# EAGLE design Tracksoar v2 breakout (EAGLE 9.0.0)
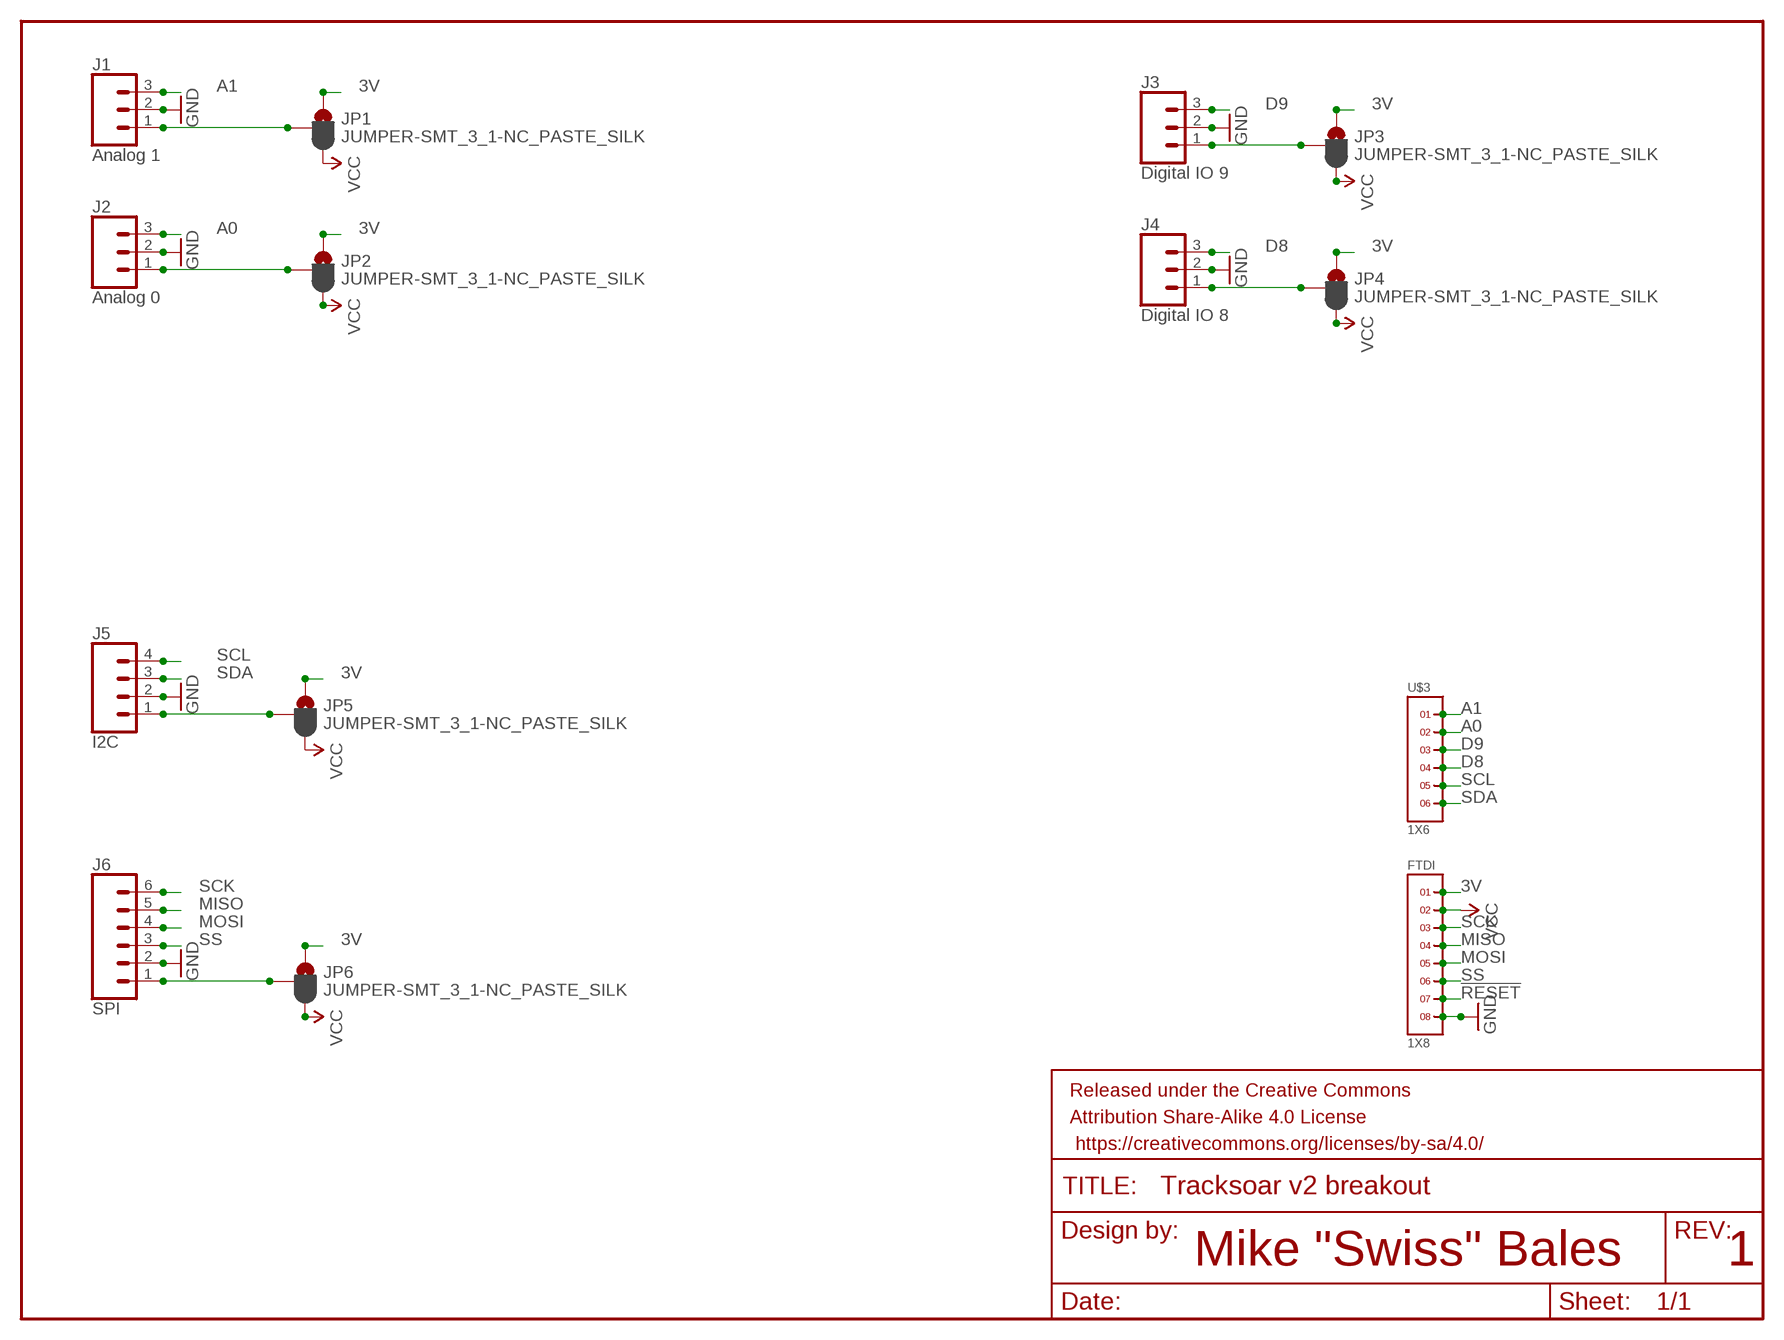
[diagram p0: schematic, sheet 1]

## Parts
FRAME1  FRAME-LETTER  [CREATIVE_COMMONS]
FTDI  1X8  [1X8]
J1  Analog 1  CONN_03LONGPADS  [1X03_LONGPADS]
J2  Analog 0  CONN_03LONGPADS  [1X03_LONGPADS]
J3  Digital IO 9  CONN_03LONGPADS  [1X03_LONGPADS]
J4  Digital IO 8  CONN_03LONGPADS  [1X03_LONGPADS]
J5  I2C  CONN_04LONGPADS  [1X04_LONGPADS]
J6  SPI  CONN_06LONGPADS  [1X06_LONGPADS]
JP1  JUMPER-SMT_3_1-NC_PASTE_SILK  [SMT-JUMPER_3_1-NC_PASTE_SILK]
JP2  JUMPER-SMT_3_1-NC_PASTE_SILK  [SMT-JUMPER_3_1-NC_PASTE_SILK]
JP3  JUMPER-SMT_3_1-NC_PASTE_SILK  [SMT-JUMPER_3_1-NC_PASTE_SILK]
JP4  JUMPER-SMT_3_1-NC_PASTE_SILK  [SMT-JUMPER_3_1-NC_PASTE_SILK]
JP5  JUMPER-SMT_3_1-NC_PASTE_SILK  [SMT-JUMPER_3_1-NC_PASTE_SILK]
JP6  JUMPER-SMT_3_1-NC_PASTE_SILK  [SMT-JUMPER_3_1-NC_PASTE_SILK]
U$3  1X6  [1X6]

## Nets
3V: FTDI.1 JP1.1 JP2.1 JP3.1 JP4.1 JP5.1 JP6.1
!RESET: FTDI.7
A0: J2.3 U$3.2
A1: J1.3 U$3.1
D8: J4.3 U$3.4
D9: J3.3 U$3.3
GND: FTDI.8 J1.2 J2.2 J3.2 J4.2 J5.2 J6.2
MISO: FTDI.4 J6.5
MOSI: FTDI.5 J6.4
N$1: J1.1 JP1.2
N$2: J2.1 JP2.2
N$3: J3.1 JP3.2
N$6: J4.1 JP4.2
N$7: J5.1 JP5.2
N$8: J6.1 JP6.2
SCK: FTDI.3 J6.6
SCL: J5.4 U$3.5
SDA: J5.3 U$3.6
SS: FTDI.6 J6.3
VCC: FTDI.2 JP1.3 JP2.3 JP3.3 JP4.3 JP5.3 JP6.3

## Notes on the sheet
- Mike "Swiss" Bales | 1

## Library data of the parts
FRAME1 = SparkFun-Aesthetics:FRAME-LETTER: Schematic Frame Standard 8.5x11 US Letter frame
FTDI = headers(2mm):1X8
J1-J4 = SparkFun-Connectors:CONN_03: Multi connection point. Often used as Generic Header-pin footprint for 0.1 inch spaced/style header connections On any of the 0.1 inch spaced packages, you can populate with these: Break Away Headers - Straight <https://www.sparkfun.com/products/116> (PRT-00116) Break Away Male Headers - Right Angle <https://www.sparkfun.com/products/553> (PRT-00553) Female Headers <https://www.sparkfun.com/products/115> (PRT-00115) Break Away Headers - Machine Pin <https://www.sparkfun.com/products/117> (PRT-00117) Break Away Female Headers - Swiss Machine Pin <https://www.sparkfun.com/products/743> (PRT-00743) Stackable Header - 3 Pin (Female, 0.1") <https://www.sparkfun.com/products/13875> (PRT-13875) For SCREWTERMINALS and SPRING TERMINALS visit here: Screw Terimnals on SparkFun.com <https://www.sparkfun.com/search/results?term=Screw+Terminals> (5mm/3.5mm/2.54mm spacing) This device is also useful as a general connection point to wire up your design to another part of your project. Our various solder wires solder well into these plated through hole pads. Hook-Up Wire - Assortment (Stranded, 22 AWG) <https://www.sparkfun.com/products/11375> (PRT-11375) Hook-Up Wire - Assortment (Solid Core, 22 AWG) <https://www.sparkfun.com/products/11367> (PRT-11367) View the entire wire category on our website here <https://www.sparkfun.com/categories/141> Special notes: Molex polarized connector foot print use with SKU : PRT-08232 with associated crimp pins and housings.
J5 = SparkFun-Connectors:CONN_04: Multi connection point. Often used as Generic Header-pin footprint for 0.1 inch spaced/style header connections On any of the 0.1 inch spaced packages, you can populate with these: Break Away Headers - Straight <https://www.sparkfun.com/products/116> (PRT-00116) Break Away Male Headers - Right Angle <https://www.sparkfun.com/products/553> (PRT-00553) Female Headers <https://www.sparkfun.com/products/115> (PRT-00115) Break Away Headers - Machine Pin <https://www.sparkfun.com/products/117> (PRT-00117) Break Away Female Headers - Swiss Machine Pin <https://www.sparkfun.com/products/743> (PRT-00743) For SCREWTERMINALS and SPRING TERMINALS visit here: Screw Terimnals on SparkFun.com <https://www.sparkfun.com/search/results?term=Screw+Terminals> (5mm/3.5mm/2.54mm spacing) This device is also useful as a general connection point to wire up your design to another part of your project. Our various solder wires solder well into these plated through hole pads. Hook-Up Wire - Assortment (Stranded, 22 AWG) <https://www.sparkfun.com/products/11375> (PRT-11375) Hook-Up Wire - Assortment (Solid Core, 22 AWG) <https://www.sparkfun.com/products/11367> (PRT-11367) View the entire wire category on our website here <https://www.sparkfun.com/categories/141> Special notes: Molex polarized connector foot print use with SKU : PRT-08231 with associated crimp pins and housings. 1MM SMD Version SKU: PRT-10208; PROD_ID: CONN-09696
J6 = SparkFun-Connectors:CONN_06: Multi connection point. Often used as Generic Header-pin footprint for 0.1 inch spaced/style header connections On any of the 0.1 inch spaced packages, you can populate with these: Break Away Headers - Straight <https://www.sparkfun.com/products/116> (PRT-00116) Break Away Male Headers - Right Angle <https://www.sparkfun.com/products/553> (PRT-00553) Female Headers <https://www.sparkfun.com/products/115> (PRT-00115) Break Away Headers - Machine Pin <https://www.sparkfun.com/products/117> (PRT-00117) Break Away Female Headers - Swiss Machine Pin <https://www.sparkfun.com/products/743> (PRT-00743) Arduino Stackable Header - 6 Pin <https://www.sparkfun.com/products/9280> (PRT-09280) For SCREWTERMINALS and SPRING TERMINALS visit here: Screw Terimnals on SparkFun.com <https://www.sparkfun.com/search/results?term=Screw+Terminals> (5mm/3.5mm/2.54mm spacing) This device is also useful as a general connection point to wire up your design to another part of your project. Our various solder wires solder well into these plated through hole pads. Hook-Up Wire - Assortment (Stranded, 22 AWG) <https://www.sparkfun.com/products/11375> (PRT-11375) Hook-Up Wire - Assortment (Solid Core, 22 AWG) <https://www.sparkfun.com/products/11367> (PRT-11367) View the entire wire category on our website here <https://www.sparkfun.com/categories/141>
JP1-JP6 = SparkFun-Jumpers:JUMPER-SMT_3_1-NC_PASTE: Normally closed solder jumper (1 of 2 connections) This jumper has an aperture in the stencil to allow solder paste to bridge one of the two connections. One connection is normally closed (NC), while the other is normally open (NO). Wick off the solder to open the connection. Reapply solder to reclose the connection. Apply solder to the other side instead to change the current path.
U$3 = headers(2mm):1X6

## Board
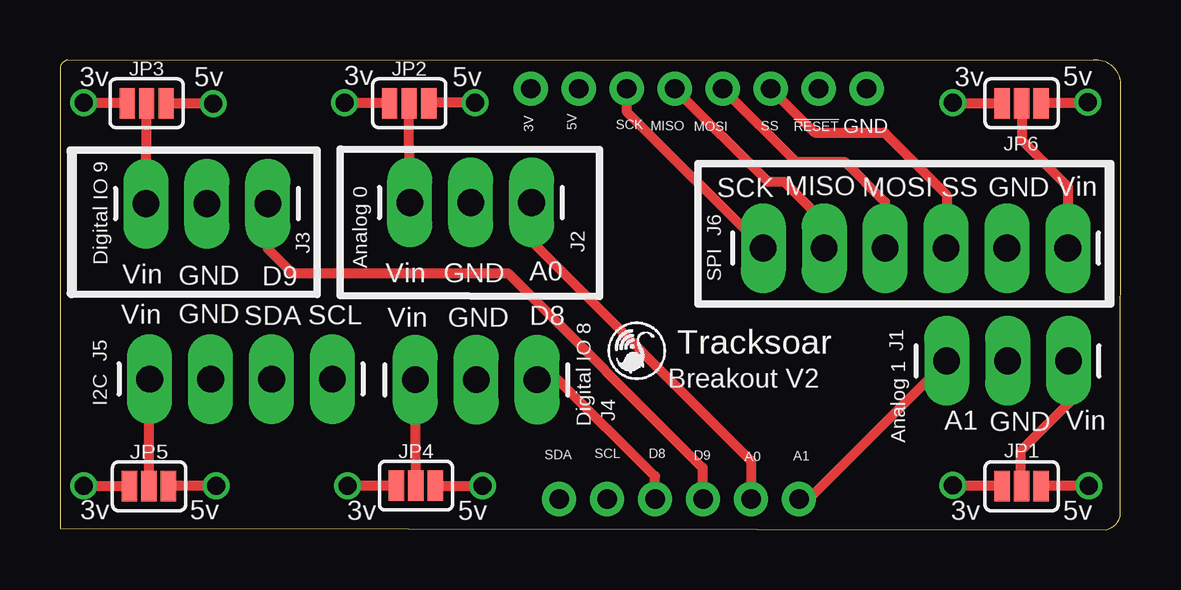
[diagram p1: board, top side]
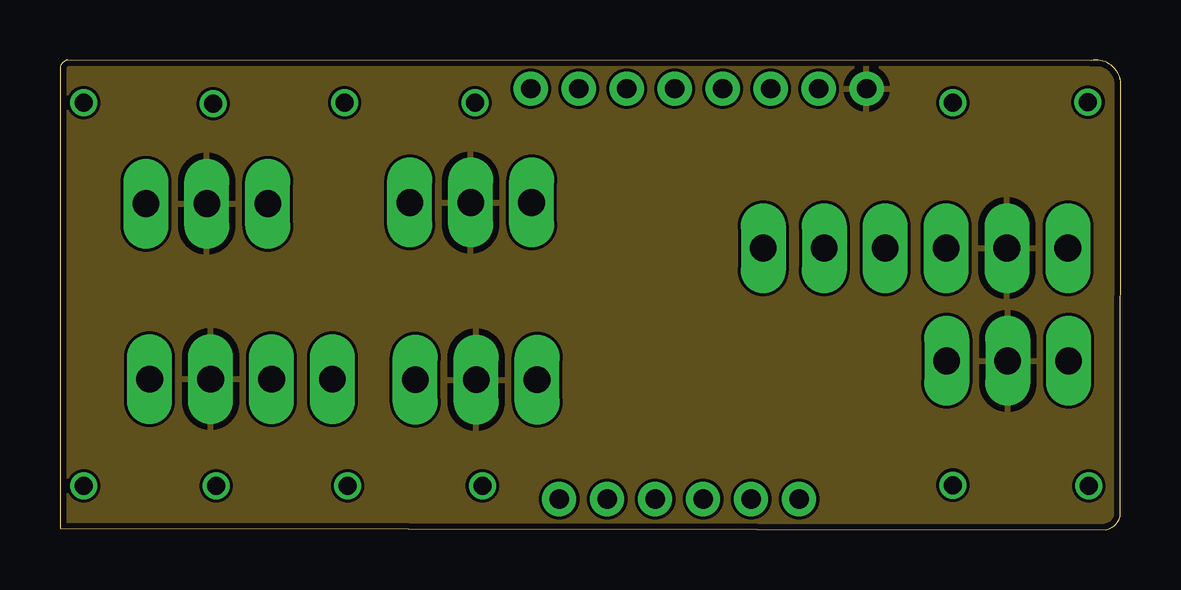
[diagram p2: board, inner layer Route2]
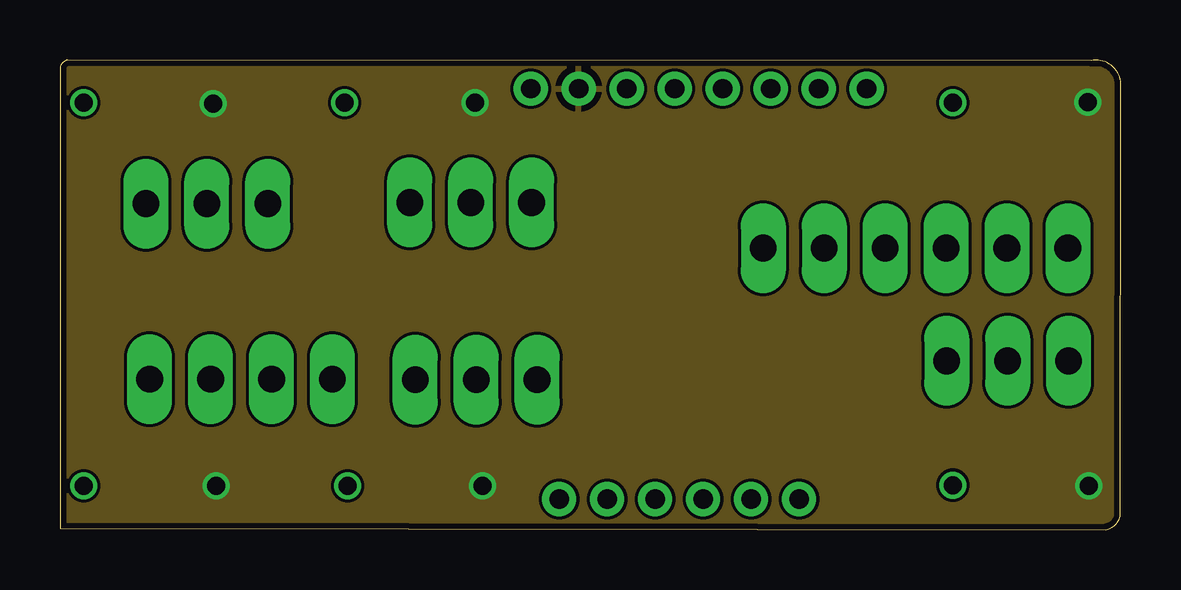
[diagram p3: board, inner layer Route15]
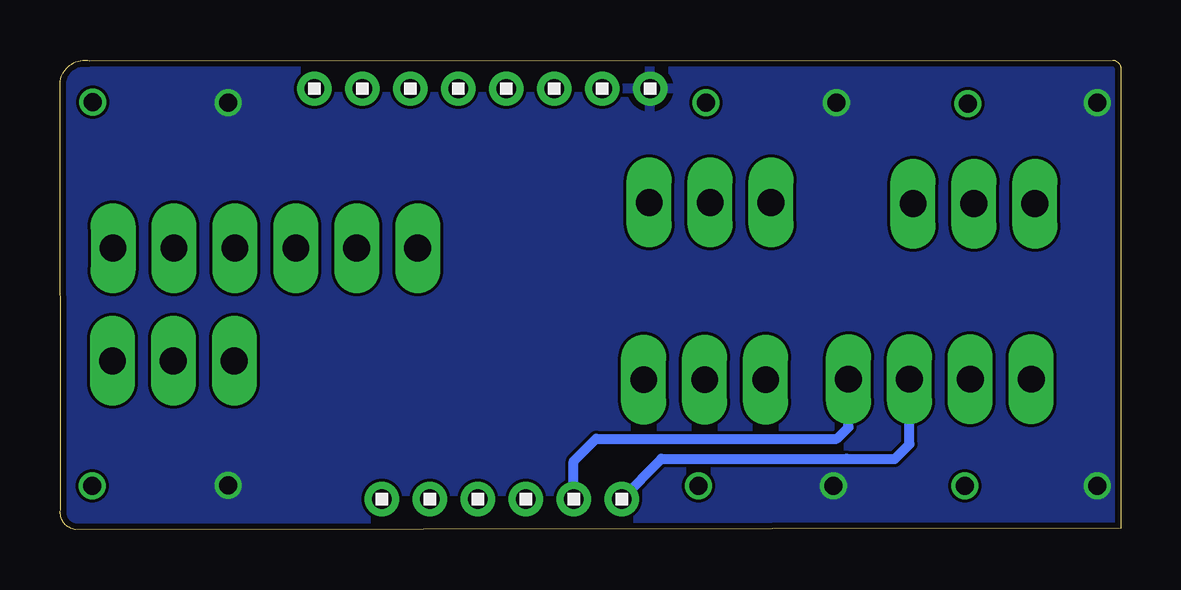
[diagram p4: board, bottom side, seen from below]

Size 44.22 x 19.58 mm. Coordinates in mm from the lower left corner, seen from the top.
Outline: 43.59,0 arc90 44.2,0.81 44.22,18.69 arc90 42.98,19.56 0.33,19.58 arc90 0,19.15 0,0.05 43.59,0
Copper layers (1*2*15*16): Top 0.035mm / dielectric 0.23mm / Route2 0.035mm / dielectric 0.93mm / Route15 0.035mm / dielectric 0.23mm / Bottom 0.035mm
Design rules "MF_Standard_4_Layer": minimum track width 5mil, minimum drill 12mil, track to track 5mil, track to pad 5mil, pad to pad 5mil, via to via 5mil, smd to smd 0mil, copper to edge 10mil, drill to drill 10mil, minimum pad ring 6mil, minimum via ring 6mil, stop-mask expansion 2mil, vias tented up to drill 25mil, thermal gap 10mil

### Footprints (pad centres in the part's own frame; a part is rotated, then mirrored left to right if it is on the bottom)
1X8 = drill 0.8 pad 1.422: 1 -7,0; 2 -5,0; 3 -3,0; 4 -1,0; 5 1,0; 6 3,0; 7 5,0; 8 7,0
1X03_LONGPADS = drill 1.118 pad 1.88 long: 1 0,0; 2 2.54,0; 3 5.08,0
1X04_LONGPADS = drill 1.118 pad 1.88 long: 1 0,0; 2 2.54,0; 3 5.08,0; 4 7.62,0
1X06_LONGPADS = drill 1.118 pad 1.88 long: 1 0,0; 2 2.54,0; 3 5.08,0; 4 7.62,0; 5 10.16,0; 6 12.7,0
SMT-JUMPER_3_1-NC_PASTE_SILK = smd 0.635 x 1.27: 1 -0.813,0; 2 0,0; 3 0.813,0
1X6 = drill 0.8 pad 1.422: 1 -5,0; 2 -3,0; 3 -1,0; 4 1,0; 5 3,0; 6 5,0

### Placement (x,y rotation side)
FRAME1  42.19,-8.13 0 top  (outside the outline)
FTDI  26.62,18.39 180 bottom
J1  42.04,7.04 180 top
J2  14.58,13.64 0 top
J3  3.58,13.59 0 top
J4  14.81,6.25 0 top
J5  3.74,6.27 0 top
J6  42.01,11.73 180 top
JP1  40.08,1.8 0 top
JP2  14.56,17.78 0 top
JP3  3.61,17.78 0 top
JP4  14.84,1.83 0 top
JP5  3.71,1.8 0 top
JP6  40.08,17.78 0 top
U$3  25.81,1.27 0 bottom

### Tracks (layer width: path | path; a pad name or v marks a point on that pad's centre or on a via)
3V  (via drill 0.75)
  Top 0.406: JP3.1 1.02,17.78 v0.99,17.81 | v0.99,1.83 2.87,1.83 JP5.1 | JP4.1 v11.99,1.83 | v37.21,17.81 37.24,17.78 JP6.1 | v37.21,1.85 39.22,1.85 JP1.1 | JP2.1 11.89,17.78 v11.87,17.81
  pour Bottom: 0.05,19.56 44.2,19.56 44.2,-0.15 0.05,-0.15
A0
  Top 0.406: J2.3 19.66,12.04 28.81,2.87 U$3.2
A1
  Top 0.406: J1.3 31.19,1.27 U$3.1
D8
  Top 0.406: U$3.4 24.81,2.22 20.78,6.22 J4.3
D9
  Top 0.406: J3.3 8.66,11.71 9.68,10.69 18.67,10.69 26.78,2.58 U$3.3
GND
  pour Route2: 0.1,19.51 44.2,19.51 44.2,0.03 0.1,0.03
MISO
  Top 0.406: FTDI.4 29.51,14.5 30.18,14.5 31.86,12.83 J6.5
MOSI
  Top 0.406: FTDI.5 30.67,15.34 32.72,15.34 34.4,13.67 J6.4
N$1
  Top 0.406: J1.1 42.04,5.26 40.03,3.25 40.03,1.85 JP1.2
N$2
  Top 0.406: J2.1 JP2.2
N$3
  Top 0.406: J3.1 JP3.2
N$6
  Top 0.406: JP4.2 J4.1
N$7
  Top 0.406: JP5.2 3.71,5.69 J5.1
N$8
  Top 0.406: JP6.2 40.08,16.23 42.02,14.3 J6.1
SCK
  Top 0.406: FTDI.3 23.62,17.43 J6.6
SCL
  Bottom 0.406: U$3.5 22.81,2.85 21.87,3.78 11.84,3.78 11.36,4.27 J5.4
SDA
  Bottom 0.406: U$3.6 19.16,2.95 11.43,2.95 11.41,2.95 9.43,2.95 8.82,3.56 J5.3
SS
  Top 0.406: FTDI.6 31.45,16.56 34.37,16.56 36.96,13.94 J6.3
VCC  (via drill 0.75)
  Top 0.406: v42.88,1.83 40.92,1.83 JP1.3 | v42.85,17.83 42.8,17.78 JP6.3 | v6.51,1.83 4.55,1.83 JP5.3 | JP3.3 6.35,17.78 v6.38,17.75 | v17.3,17.81 15.4,17.81 JP2.3 | JP4.3 v17.61,1.83
  pour Route15: 0.08,19.61 44.2,19.61 44.2,-0.05 0.08,-0.05

### Text on the board
tNames: 3v | 3v | 5v | 5v | 3v | 5v | 3V | 5V | SCK | MISO | MOSI | SS | !RESET | GND | SCK | MISO | MOSI | SS | GND | Vin | Vin | GND | D9 | Vin | GND | A0 | Vin | GND | SCL | D8 | Vin | GND | SDA | Tracksoar | Breakout V2 | A1 | GND | Vin | SDA | SCL | D8 | D9 | A0 | A1 | 3v | 5v | 3v | 5v | 3v | 5v